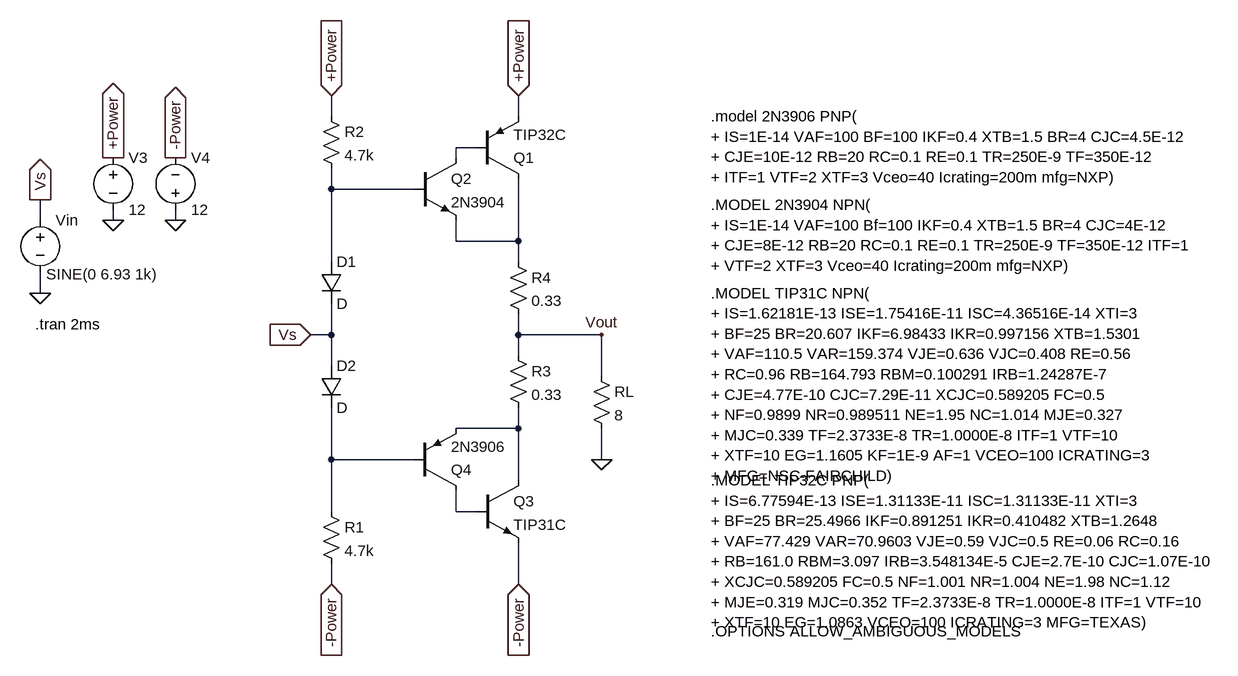
[diagram p0: schematic Power Amp.asc]
Power Amp.asc, the LTspice schematic file:
Version 4.1
SHEET 1 7092 1032
WIRE 496 -288 496 -320
WIRE 784 -288 784 -320
WIRE 720 -240 688 -240
WIRE 688 -224 688 -240
WIRE 496 -176 496 -208
WIRE 624 -176 496 -176
WIRE 48 -128 48 -160
WIRE 160 -128 160 -144
WIRE 256 -128 256 -144
WIRE 688 -96 688 -128
WIRE 784 -96 784 -192
WIRE 784 -96 688 -96
WIRE 496 -64 496 -176
WIRE 784 -64 784 -96
WIRE 48 -16 48 -48
WIRE 496 48 496 0
WIRE 496 48 464 48
WIRE 784 48 784 16
WIRE 912 48 784 48
WIRE 784 80 784 48
WIRE 496 96 496 48
WIRE 912 112 912 48
WIRE 784 192 784 160
WIRE 784 192 688 192
WIRE 496 240 496 160
WIRE 624 240 496 240
WIRE 912 240 912 192
WIRE 784 272 784 192
WIRE 496 320 496 240
WIRE 688 320 688 288
WIRE 720 320 688 320
WIRE 496 432 496 400
WIRE 784 432 784 368
FLAG 256 -224 -Power
IOPIN 256 -224 Out
FLAG 160 -224 +Power
IOPIN 160 -224 Out
FLAG 160 -128 0
FLAG 256 -128 0
FLAG 48 -16 0
FLAG 48 -160 Vs
IOPIN 48 -160 Out
FLAG 496 -320 +Power
IOPIN 496 -320 In
FLAG 784 -320 +Power
IOPIN 784 -320 In
FLAG 784 432 -Power
IOPIN 784 432 In
FLAG 912 240 0
FLAG 464 48 Vs
IOPIN 464 48 In
FLAG 496 432 -Power
IOPIN 496 432 In
FLAG 912 48 Vout
SYMBOL voltage 160 -240 R0
WINDOW 123 0 0 Left 0
WINDOW 39 0 0 Left 0
SYMATTR InstName V3
SYMATTR Value 12
SYMBOL voltage 256 -128 M180
WINDOW 0 24 96 Left 2
WINDOW 3 24 16 Left 2
WINDOW 123 0 0 Left 0
WINDOW 39 0 0 Left 0
SYMATTR InstName V4
SYMATTR Value 12
SYMBOL voltage 48 -144 R0
WINDOW 123 0 0 Left 0
WINDOW 39 0 0 Left 0
WINDOW 3 9 99 Left 2
SYMATTR Value SINE(0 6.93 1k)
SYMATTR InstName Vin
SYMBOL npn 624 -224 R0
SYMATTR InstName Q2
SYMATTR Value 2N3904
SYMBOL npn 720 272 R0
SYMATTR InstName Q3
SYMATTR Value TIP31C
SYMBOL pnp 624 288 M180
SYMATTR InstName Q4
SYMATTR Value 2N3906
SYMBOL diode 480 -64 R0
SYMATTR InstName D1
SYMBOL diode 480 96 R0
SYMATTR InstName D2
SYMBOL res 480 -304 R0
SYMATTR InstName R2
SYMATTR Value 4.7k
SYMBOL res 896 96 R0
SYMATTR InstName RL
SYMATTR Value 8
SYMBOL res 480 304 R0
SYMATTR InstName R1
SYMATTR Value 4.7k
SYMBOL res 768 64 R0
SYMATTR InstName R3
SYMATTR Value 0.33
SYMBOL res 768 -80 R0
SYMATTR InstName R4
SYMATTR Value 0.33
SYMBOL pnp 720 -192 M180
SYMATTR InstName Q1
SYMATTR Value TIP32C
TEXT 40 32 Left 2 !.tran 2ms
TEXT 1080 -152 Left 2 !.MODEL 2N3904 NPN(\n+ IS=1E-14 VAF=100 Bf=100 IKF=0.4 XTB=1.5 BR=4 CJC=4E-12\n+ CJE=8E-12 RB=20 RC=0.1 RE=0.1 TR=250E-9 TF=350E-12 ITF=1\n+ VTF=2 XTF=3 Vceo=40 Icrating=200m mfg=NXP)
TEXT 1080 -16 Left 2 !.MODEL TIP31C NPN(\n+ IS=1.62181E-13 ISE=1.75416E-11 ISC=4.36516E-14 XTI=3\n+ BF=25 BR=20.607 IKF=6.98433 IKR=0.997156 XTB=1.5301\n+ VAF=110.5 VAR=159.374 VJE=0.636 VJC=0.408 RE=0.56\n+ RC=0.96 RB=164.793 RBM=0.100291 IRB=1.24287E-7\n+ CJE=4.77E-10 CJC=7.29E-11 XCJC=0.589205 FC=0.5\n+ NF=0.9899 NR=0.989511 NE=1.95 NC=1.014 MJE=0.327\n+ MJC=0.339 TF=2.3733E-8 TR=1.0000E-8 ITF=1 VTF=10\n+ XTF=10 EG=1.1605 KF=1E-9 AF=1 VCEO=100 ICRATING=3\n+ MFG=NSC-FAIRCHILD)
TEXT 1080 -288 Left 2 !.model 2N3906 PNP(\n+ IS=1E-14 VAF=100 BF=100 IKF=0.4 XTB=1.5 BR=4 CJC=4.5E-12\n+ CJE=10E-12 RB=20 RC=0.1 RE=0.1 TR=250E-9 TF=350E-12\n+ ITF=1 VTF=2 XTF=3 Vceo=40 Icrating=200m mfg=NXP)
TEXT 1080 272 Left 2 !.MODEL TIP32C PNP(\n+ IS=6.77594E-13 ISE=1.31133E-11 ISC=1.31133E-11 XTI=3\n+ BF=25 BR=25.4966 IKF=0.891251 IKR=0.410482 XTB=1.2648\n+ VAF=77.429 VAR=70.9603 VJE=0.59 VJC=0.5 RE=0.06 RC=0.16\n+ RB=161.0 RBM=3.097 IRB=3.548134E-5 CJE=2.7E-10 CJC=1.07E-10\n+ XCJC=0.589205 FC=0.5 NF=1.001 NR=1.004 NE=1.98 NC=1.12\n+ MJE=0.319 MJC=0.352 TF=2.3733E-8 TR=1.0000E-8 ITF=1 VTF=10\n+ XTF=10 EG=1.0863 VCEO=100 ICRATING=3 MFG=TEXAS)
TEXT 1080 504 Left 2 !.OPTIONS ALLOW_AMBIGUOUS_MODELS

The netlist it stands for:
* Power Amp.asc
V3 +Power 0 12
V4 0 -Power 12
Vin Vs 0 SINE(0 6.93 1k)
Q2 N001 N002 N003 0 2N3904
Q3 N004 N006 -Power 0 TIP31C
Q4 N006 N005 N004 0 2N3906
D1 N002 Vs D
D2 Vs N005 D
R2 +Power N002 4.7k
RL Vout 0 8
R1 N005 -Power 4.7k
R3 Vout N004 0.33
R4 N003 Vout 0.33
Q1 N003 N001 +Power 0 TIP32C
.model D D
.lib standard.dio
.model NPN NPN
.model PNP PNP
.lib standard.bjt
.tran 2ms
.MODEL 2N3904 NPN(
+ IS=1E-14 VAF=100 Bf=100 IKF=0.4 XTB=1.5 BR=4 CJC=4E-12
+ CJE=8E-12 RB=20 RC=0.1 RE=0.1 TR=250E-9 TF=350E-12 ITF=1
+ VTF=2 XTF=3 Vceo=40 Icrating=200m mfg=NXP)
.MODEL TIP31C NPN(
+ IS=1.62181E-13 ISE=1.75416E-11 ISC=4.36516E-14 XTI=3
+ BF=25 BR=20.607 IKF=6.98433 IKR=0.997156 XTB=1.5301
+ VAF=110.5 VAR=159.374 VJE=0.636 VJC=0.408 RE=0.56
+ RC=0.96 RB=164.793 RBM=0.100291 IRB=1.24287E-7
+ CJE=4.77E-10 CJC=7.29E-11 XCJC=0.589205 FC=0.5
+ NF=0.9899 NR=0.989511 NE=1.95 NC=1.014 MJE=0.327
+ MJC=0.339 TF=2.3733E-8 TR=1.0000E-8 ITF=1 VTF=10
+ XTF=10 EG=1.1605 KF=1E-9 AF=1 VCEO=100 ICRATING=3
+ MFG=NSC-FAIRCHILD)
.model 2N3906 PNP(
+ IS=1E-14 VAF=100 BF=100 IKF=0.4 XTB=1.5 BR=4 CJC=4.5E-12
+ CJE=10E-12 RB=20 RC=0.1 RE=0.1 TR=250E-9 TF=350E-12
+ ITF=1 VTF=2 XTF=3 Vceo=40 Icrating=200m mfg=NXP)
.MODEL TIP32C PNP(
+ IS=6.77594E-13 ISE=1.31133E-11 ISC=1.31133E-11 XTI=3
+ BF=25 BR=25.4966 IKF=0.891251 IKR=0.410482 XTB=1.2648
+ VAF=77.429 VAR=70.9603 VJE=0.59 VJC=0.5 RE=0.06 RC=0.16
+ RB=161.0 RBM=3.097 IRB=3.548134E-5 CJE=2.7E-10 CJC=1.07E-10
+ XCJC=0.589205 FC=0.5 NF=1.001 NR=1.004 NE=1.98 NC=1.12
+ MJE=0.319 MJC=0.352 TF=2.3733E-8 TR=1.0000E-8 ITF=1 VTF=10
+ XTF=10 EG=1.0863 VCEO=100 ICRATING=3 MFG=TEXAS)
.OPTIONS ALLOW_AMBIGUOUS_MODELS
.backanno
.end